# EAGLE design picoxcvr (EAGLE 7.7.0)
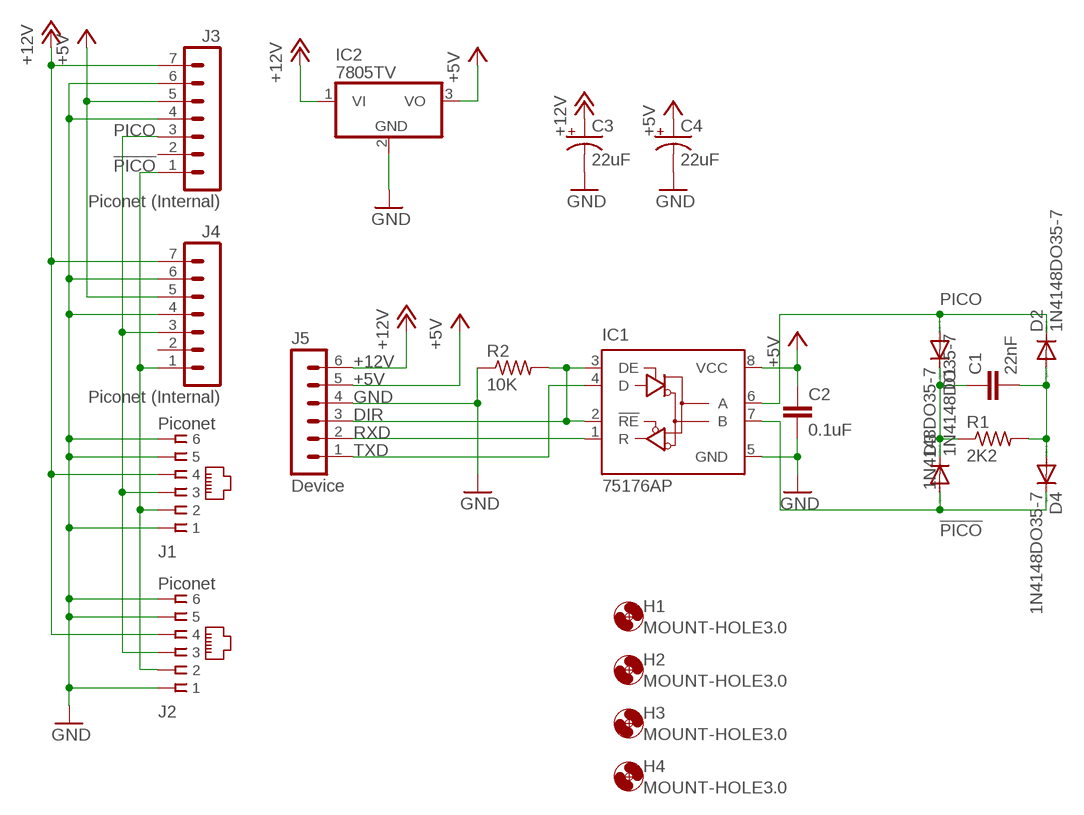
[diagram p0: schematic, sheet 1]

## Parts
C1  22nF  C-EU050-024X044  [C050-024X044]
C2  0.1uF  C-EU050-024X044  [C050-024X044]
C3  22uF  CPOL-USE2.5-6  [E2,5-6]
C4  22uF  CPOL-USE2.5-6  [E2,5-6]
D1  1N4148DO35-7  [DO35-7]
D2  1N4148DO35-7  [DO35-7]
D3  1N4148DO35-7  [DO35-7]
D4  1N4148DO35-7  [DO35-7]
H1  MOUNT-HOLE3.0  [3,0]
H2  MOUNT-HOLE3.0  [3,0]
H3  MOUNT-HOLE3.0  [3,0]
H4  MOUNT-HOLE3.0  [3,0]
IC1  75176AP  [DIL08]
IC2  7805TV  [TO220V]
J1  Piconet  RJ11-2X  [RJ11-NO_SHIELD]
J2  Piconet  RJ11-2X  [RJ11-NO_SHIELD]
J3  Piconet (Internal)  MA07-1  [MA07-1]
J4  Piconet (Internal)  MA07-1  [MA07-1]
J5  Device  MA06-1  [MA06-1]
R1  2K2  R-US_0204/7  [0204/7]
R2  10K  R-US_0204/7  [0204/7]

## Nets
!PICO: D3.A D4.C IC1.7(B) J1.2 J2.2 J3.1 J4.1
+5V: C2.1 C4.+ IC1.8(VCC) IC2.3(VO) J3.5 J4.5 J5.5
+12V: C3.+ IC2.1(VI) J1.4 J2.4 J3.7 J4.7 J5.6
DIR: IC1.2(!RE) IC1.3(DE) J5.3 R2.2
GND: C2.2 C3.- C4.- IC1.5(GND) IC2.2(GND) J1.1 J1.5 J1.6 J2.1 J2.5 J2.6 J3.4 J3.6 J4.4 J4.6 J5.4 R2.1
N$1: C1.1 D1.C D3.C R1.1
N$2: C1.2 D2.A D4.A R1.2
PICO: D1.A D2.C IC1.6(A) J1.3 J2.3 J3.3 J4.3
RXD: IC1.1(R) J5.2
TXD: IC1.4(D) J5.1
Unconnected: J3.2 J4.2

## Library data of the parts
C1 C2 = rcl:C-EU: CAPACITOR, European symbol
C3 C4 = rcl:CPOL-US: POLARIZED CAPACITOR, American symbol
D1-D4 = diode:1N4148: DIODE high speed (Philips)
H1-H4 = holes:MOUNT-HOLE: MOUNTING HOLE with drill center marker
IC1 = 751xx:75176A: DIFFERENTIAL BUS TRANSCEIVER Source: http://focus.ti.com/lit/ds/symlink/sn75176a.pdf
IC2 = linear:78*: Positive VOLTAGE REGULATOR Source: http://cache.national.com/ds/LM/LM78L05.pdf http://www.fairchildsemi.com/ds/LM/LM7805.pdf
J1 J2 = con-tycoelectronics:RJ11: CORCOM Modular RJ Jacks No Shield Source: www.tycoelectronics.com .. ENG_DS_1654001_1099_RJ_L_0507.pdf; OC_FARNELL: unknown; OC_NEWARK: unknown
J3 J4 = con-lstb:MA07-1: PIN HEADER; OC_FARNELL: unknown; OC_NEWARK: unknown
J5 = con-lstb:MA06-1: PIN HEADER; OC_FARNELL: unknown; OC_NEWARK: unknown
R1 R2 = rcl:R-US_: RESISTOR, American symbol

## Board
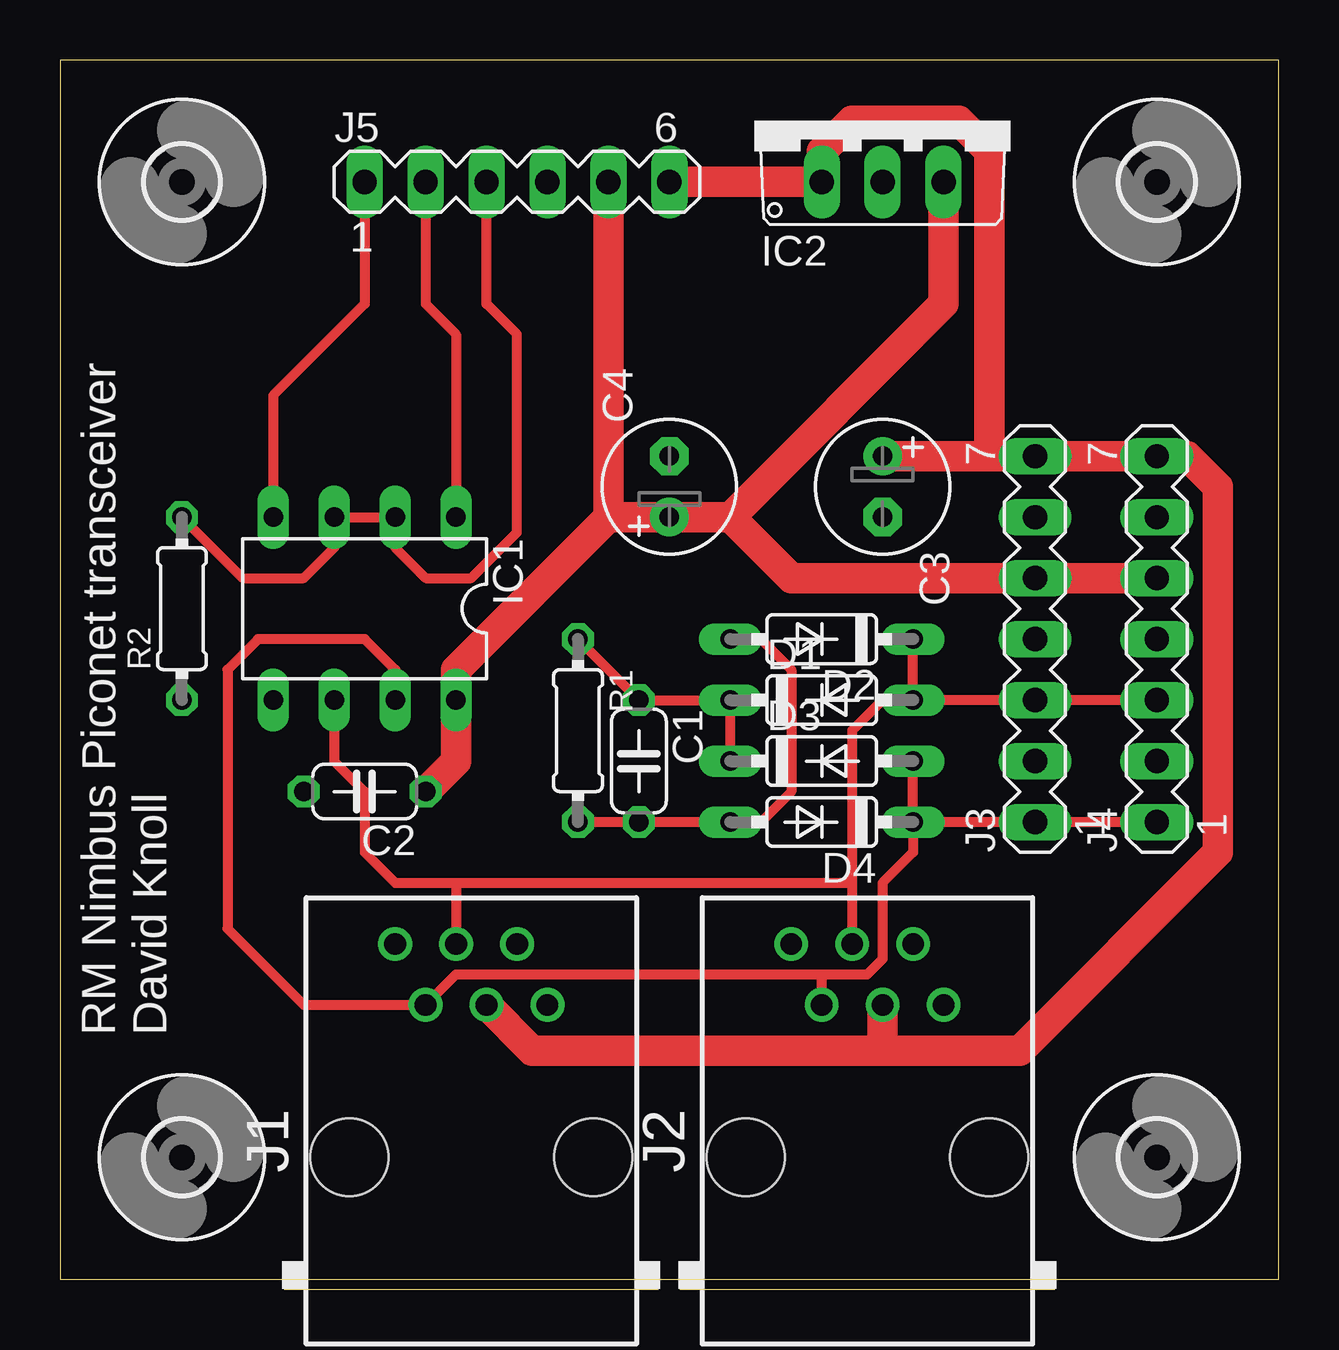
[diagram p1: board, top side]
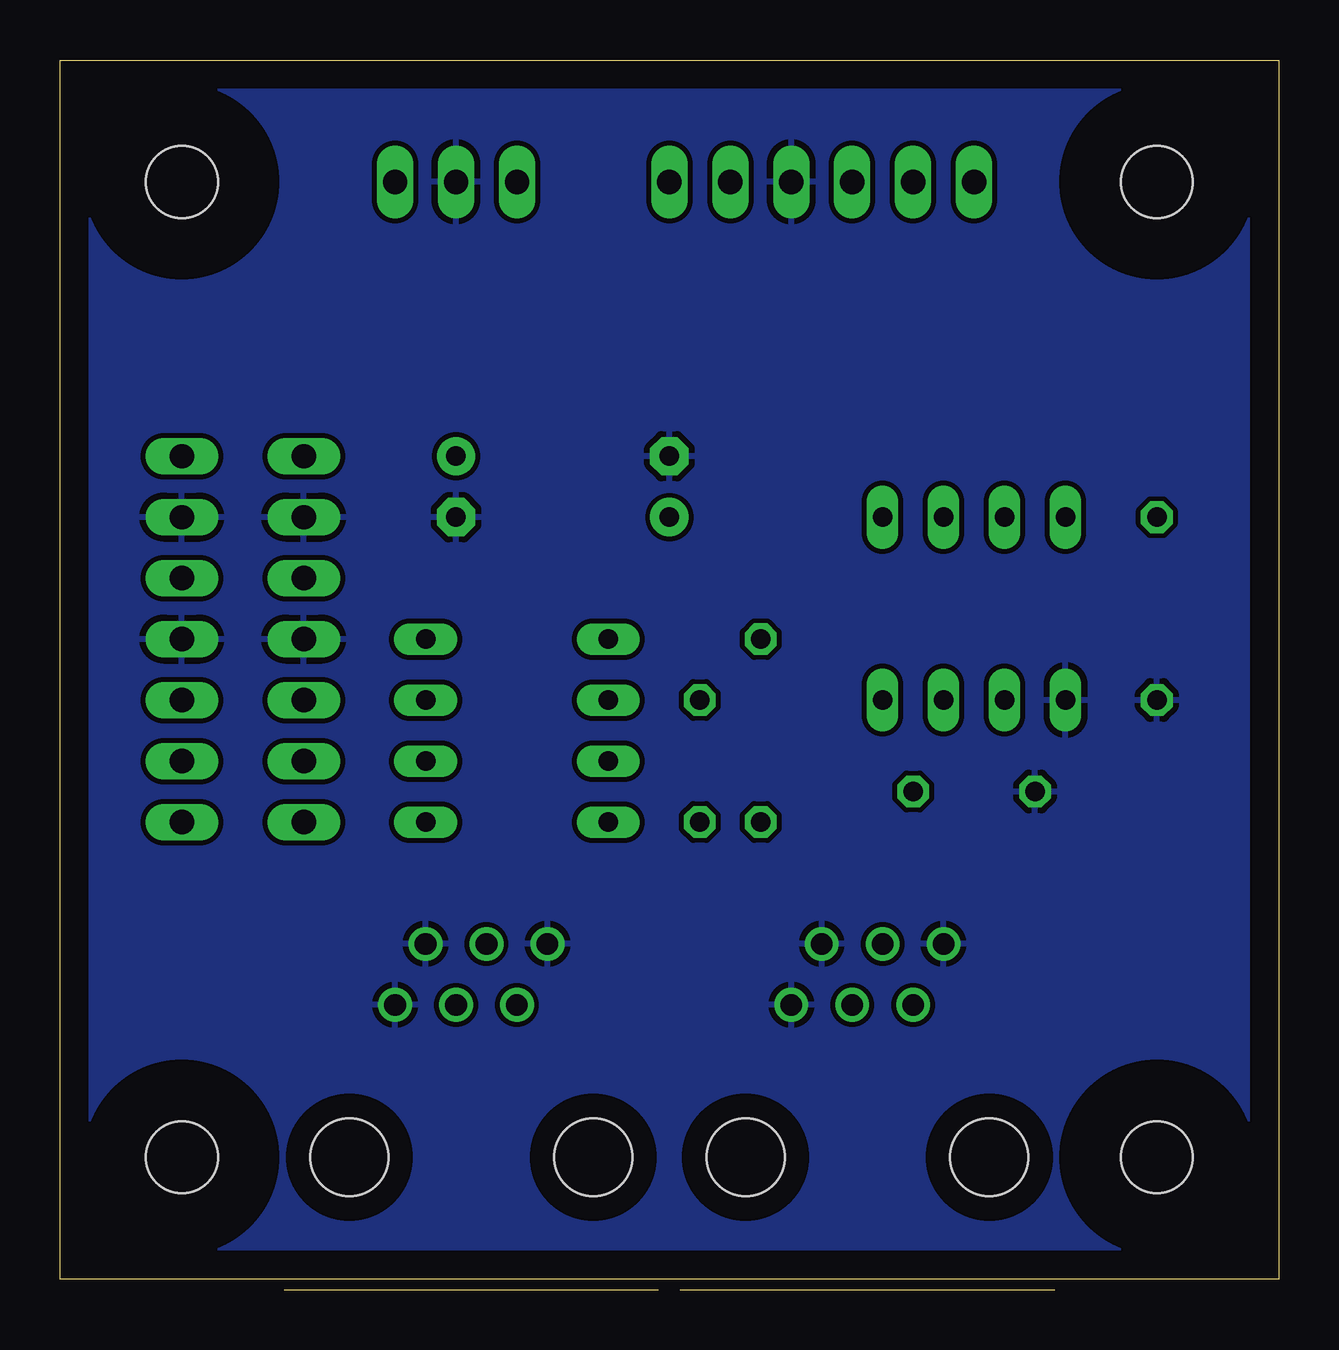
[diagram p2: board, bottom side, seen from below]

Size 50.8 x 50.8 mm. Coordinates in mm from the lower left corner, seen from the top.
Outline: 0,0 50.8,0 50.8,50.8 0,50.8 0,0
Copper layers (1*16): Top 0.035mm / dielectric 1.5mm / Bottom 0.035mm
Design rules "default": minimum track width 10mil, minimum drill 24mil, track to track 8mil, track to pad 8mil, pad to pad 8mil, via to via 8mil, smd to smd 8mil, copper to edge 40mil, drill to drill 8mil, minimum pad ring 10mil, minimum via ring 8mil, stop-mask expansion 4mil, vias tented up to drill 0mil, thermal gap 10mil

### Footprints (pad centres in the part's own frame; a part is rotated, then mirrored left to right if it is on the bottom)
C050-024X044 = drill 0.813 octagon: 1 -2.54,0; 2 2.54,0
E2,5-6 = drill 0.813 pad 1.6: + -1.27,0 | drill 0.813 pad 1.6 octagon: - 1.27,0
DO35-7 = drill 0.813 long: A 3.81,0; C -3.81,0
3,0 = hole 3: 0,0
DIL08 = drill 0.813 long: 1 -3.81,-3.81; 2 -1.27,-3.81; 3 1.27,-3.81; 4 3.81,-3.81; 5 3.81,3.81; 6 1.27,3.81; 7 -1.27,3.81; 8 -3.81,3.81
TO220V = drill 1.016 long: 1 -2.54,-2.54; 2 0,-2.54; 3 2.54,-2.54
RJ11-NO_SHIELD = drill 0.9 pad 1.4: 1 -3.175,8.89; 2 -1.905,6.35; 3 -0.635,8.89; 4 0.635,6.35; 5 1.905,8.89; 6 3.175,6.35 | hole 3.251: -5.08,0; 5.08,0
MA07-1 = drill 1.016 long: 1 -7.62,0; 2 -5.08,0; 3 -2.54,0; 4 0,0; 5 2.54,0; 6 5.08,0; 7 7.62,0
MA06-1 = drill 1.016 long: 1 -6.35,0; 2 -3.81,0; 3 -1.27,0; 4 1.27,0; 5 3.81,0; 6 6.35,0
0204/7 = drill 0.813 octagon: 1 -3.81,0; 2 3.81,0

### Placement (x,y rotation side)
C1  24.13,21.59 270 top
C2  12.7,20.32 180 top
C3  34.29,33.02 270 top
C4  25.4,33.02 90 top
D1  31.75,24.13 0 top
D2  31.75,26.67 180 top
D3  31.75,21.59 0 top
D4  31.75,19.05 180 top
H1  5.08,5.08 0 top
H2  45.72,45.72 0 top
H3  5.08,45.72 0 top
H4  45.72,5.08 0 top
IC1  12.7,27.94 180 top
IC2  34.29,48.26 0 top
J1  17.14,5.08 0 top
J2  33.66,5.08 0 top
J3  40.64,26.67 90 top
J4  45.72,26.67 90 top
J5  19.05,45.72 0 top
R1  21.59,22.86 270 top
R2  5.08,27.94 90 top

### Tracks (layer width: path | path; a pad name or v marks a point on that pad's centre or on a via)
!PICO
  Top 0.406: J4.1 J3.1 D4.C | D4.C D3.A | D4.C 35.56,17.78 34.29,16.51 34.29,13.34 33.66,12.7 31.75,12.7 | 31.75,12.7 16.51,12.7 J1.2 10.16,11.43 6.99,14.61 6.99,25.4 8.26,26.67 12.7,26.67 13.97,25.4 IC1.7 | J2.2 31.75,12.7
+5V
  Top 1.27: J4.5 J3.5 30.48,29.21 27.94,31.75 | 27.94,31.75 C4.+ 22.86,31.75 | 27.94,31.75 36.83,40.64 IC2.3 | 22.86,31.75 J5.5 | 22.86,31.75 16.51,25.4 IC1.8 16.51,21.59 C2.1
+12V
  Top 1.27: J1.4 19.68,9.53 34.29,9.53 | 34.29,9.53 J2.4 | 34.29,9.53 40.01,9.53 48.26,17.78 48.26,33.02 46.99,34.29 J4.7 J3.7 38.73,34.29 | 38.73,34.29 C3.+ | 38.73,34.29 38.73,46.99 37.47,48.26 33.02,48.26 31.75,46.99 IC2.1 28.57,45.72 J5.6
DIR
  Top 0.406: R2.2 7.62,29.21 10.16,29.21 11.43,30.48 IC1.3 IC1.2 13.97,30.48 15.24,29.21 17.14,29.21 19.05,31.11 19.05,39.37 17.78,40.64 J5.3
GND
  pour Bottom: 1.27,49.53 49.53,49.53 49.53,1.27 1.27,1.27
N$1
  Top 0.406: R1.1 C1.1 D1.C D3.C
N$2
  Top 0.406: D2.A 29.21,26.67 30.48,25.4 30.48,20.32 29.21,19.05 D4.A C1.2 R1.2
PICO
  Top 0.406: J4.3 J3.3 D1.A | D1.A D2.C | D1.A 34.29,24.13 33.02,22.86 33.02,16.51 | 33.02,16.51 J2.3 | 16.51,16.51 33.02,16.51 | 16.51,16.51 J1.3 | IC1.6 11.43,21.59 12.7,20.32 12.7,17.78 13.97,16.51 16.51,16.51
RXD
  Top 0.406: J5.2 15.24,40.64 16.51,39.37 IC1.1
TXD
  Top 0.406: J5.1 12.7,40.64 8.89,36.83 IC1.4

### Text on the board
tNames: RM Nimbus Piconet transceiver / David Knoll